# EAGLE design untitled (EAGLE 6.4)
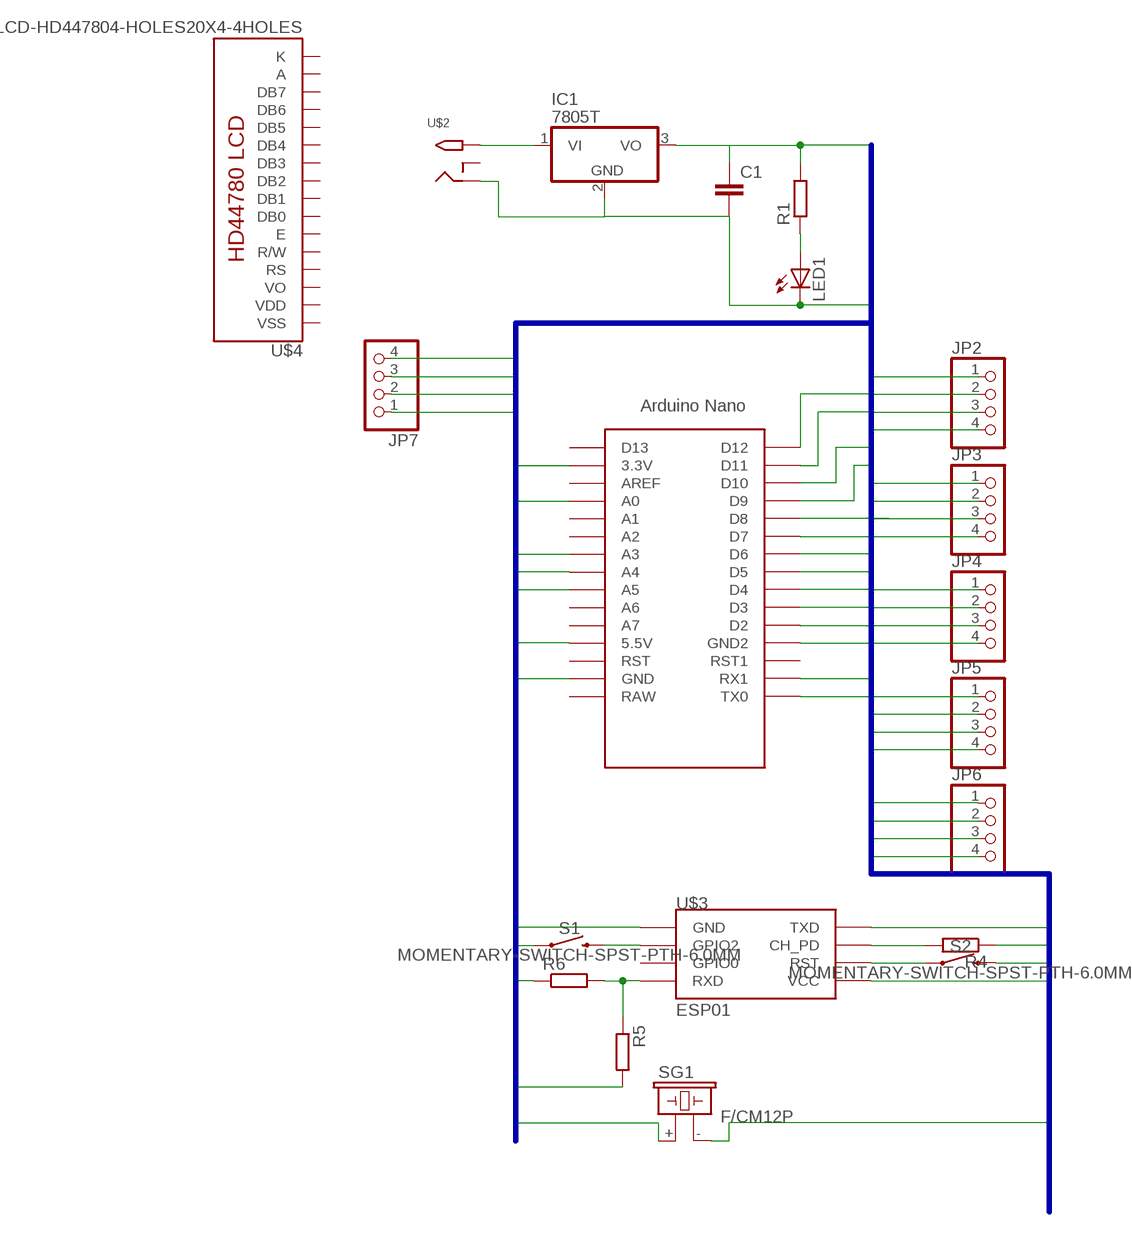
[diagram p0: schematic, sheet 1]

## Parts
C1  C-EU025-030X050  [C025-030X050]
IC1  7805T  [TO220H]
JP2  PINHD-1X4  [1X04]
JP3  PINHD-1X4  [1X04]
JP4  PINHD-1X4  [1X04]
JP5  PINHD-1X4  [1X04]
JP6  PINHD-1X4  [1X04]
JP7  PINHD-1X4  [1X04]
LED1  LED5MM  [LED5MM]
R1  R-EU_0204/7  [0204/7]
R4  R-EU_0204/7  [0204/7]
R5  R-EU_0204/7  [0204/7]
R6  R-EU_0204/7  [0204/7]
S1  MOMENTARY-SWITCH-SPST-PTH-6.0MM  [TACTILE_SWITCH_PTH_6.0MM]
S2  MOMENTARY-SWITCH-SPST-PTH-6.0MM  [TACTILE_SWITCH_PTH_6.0MM]
SG1  F/CM12P  [F/CM12P]
U$1  NANO  [NANO]
U$2  2.1MMJACKTHM  [PJ-102A]
U$3  ESP01  [ESP01]
U$4  LCD-HD447804-HOLES20X4-4HOLES  [LCD-20X4-4HOLES]

## Nets
3V: R4.1 U$1.3.3V U$3.VCC
BUZZ: SG1.+ U$1.A3
E1: JP2.3 U$1.D11
E2: JP3.3 U$1.D9
E3: JP4.3 U$1.D7
E4: JP5.3 U$1.D5
E5: JP6.3 U$1.A0
GND: C1.2 IC1.2(GND) JP2.4 JP3.4 JP4.4 JP5.4 JP6.4 JP7.1 LED1.K(C) R5.2 S1.1 S2.3 SG1.- U$1.GND U$1.GND1(GND2) U$2.RING U$3.GND
N$1: IC1.1(VI) U$2.TIP
N$2: R4.2 U$3.CH_PD
N$3: R5.1 R6.2 U$3.RX(RXD)
N$4: LED1.A R1.1
N$5: S1.3 U$3.GPIO2
N$6: S2.1 U$3.RST
RX: U$1.RX1
RXS: U$1.D3 U$3.TX(TXD)
SCL: JP7.3 U$1.A5
SDA: JP7.2 U$1.A4
T1: JP2.2 U$1.D12
T2: JP3.2 U$1.D10
T3: JP4.2 U$1.D8
T4: JP5.2 U$1.D6
T5: JP6.2 U$1.D4
TX: U$1.TX0
TXS: R6.1 U$1.D2
VCC: C1.1 IC1.3(VO) JP2.1 JP3.1 JP4.1 JP5.1 JP6.1 JP7.4 R1.2 U$1.5V(5.5V)
Unconnected: U$1.A1 U$1.A2 U$1.A6 U$1.A7 U$1.AREF U$1.D13 U$1.ICSP1 U$1.ICSP2 U$1.ICSP3 U$1.ICSP4 U$1.ICSP5 U$1.ICSP6 U$1.RAW U$1.RST U$1.RST1 U$2.RING_SW U$3.GPIO0 U$4.P$3(VO) U$4.P$4(RS) U$4.P$5(R/W) U$4.P$6(E) U$4.P$7(DB0) U$4.P$8(DB1) U$4.P$9(DB2) U$4.P$10(DB3) U$4.P$11(DB4) U$4.P$12(DB5) U$4.P$13(DB6) U$4.P$14(DB7)

## Buses
E1,T1,E2,T2,E3,T3,E4,T4,E5,T5,VCC,GND,3V,SCL,SDA,RX,TX,RXS,TXS,BUZZ

## Power pins joined to a net without a drawn wire
A: U$4.P$15(A)
K: U$4.P$16(K)
VDD: U$4.P$2(VDD)
VSS: U$4.P$1(VSS)

## Library data of the parts
C1 = rcl:C-EU: CAPACITOR, European symbol
IC1 = adafruit:78*: Positive VOLTAGE REGULATOR Added bigger pads to the TO-92 package
JP2-JP7 = pinhead:PINHD-1X4: PIN HEADER
LED1 = adafruit:LED: LED OSRAM: - CHIPLED LG R971, LG N971, LY N971, LG Q971, LY Q971, LO R971, LY R971 LH N974, LH R974 LS Q976, LO Q976, LY Q976 LO Q996 - Hyper CHIPLED LW Q18S LB Q993, LB Q99A, LB R99A - SideLED LS A670, LO A670, LY A670, LG A670, LP A670 LB A673, LV A673, LT A673, LW A673 LH A674 LY A675 LS A676, LA A676, LO A676, LY A676, LW A676 LS A679, LY A679, LG A679 - Hyper Micro SIDELED® LS Y876, LA Y876, LO Y876, LY Y876 LT Y87S - SmartLED LW L88C, LW L88S LB L89C, LB L89S, LG L890 LS L89K, LO L89K, LY L89K LS L896, LA L896, LO L896, LY L896 - TOPLED LS T670, LO T670, LY T670, LG T670, LP T670 LSG T670, LSP T670, LSY T670, LOP T670, LYG T670 LG T671, LOG T671, LSG T671 LB T673, LV T673, LT T673, LW T673 LH T674 LS T676, LA T676, LO T676, LY T676, LB T676, LH T676, LSB T676, LW T676 LB T67C, LV T67C, LT T67C, LS T67K, LO T67K, LY T67K, LW E67C LS E67B, LA E67B, LO E67B, LY E67B, LB E67C, LV E67C, LT E67C LW T67C LS T679, LY T679, LG T679 LS T770, LO T770, LY T770, LG T770, LP T770 LB T773, LV T773, LT T773, LW T773 LH T774 LS E675, LA E675, LY E675, LS T675 LS T776, LA T776, LO T776, LY T776, LB T776 LHGB T686 LT T68C, LB T68C - Hyper Mini TOPLED® LB M676 - Mini TOPLED Santana® LG M470 LS M47K, LO M47K, LY M47K Source: http://www.osram.convergy.de/
R1 R4-R6 = rcl:R-EU_: RESISTOR, European symbol
S1 S2 = SparkFun-Switches:MOMENTARY-SWITCH-SPST: Momentary Switch (Pushbutton) - SPST Normally-open (NO) SPST momentary switches (buttons, pushbuttons). Variants PTH-12MM - 12mm square, through-hole Momentary Pushbutton Switch - 12mm Square <https://www.sparkfun.com/products/9190> (COM-09190) PTH-6.0MM, PTH-6.0MM-KIT - 6.0mm square, through-hole Mini Pushbutton Switch <https://www.sparkfun.com/products/97> (COM-00097) KIT package intended for soldering kit's - only one side of pads' copper is exposed. PTH-RIGHT-ANGLE-KIT - Right-angle, through-hole Right Angle Tactile Button <https://www.sparkfun.com/products/10791> - Used on SparkFun BigTime Watch Kit <https://www.sparkfun.com/products/11734> SMD-12MM - 12mm square, surface-mount Tactile Button - SMD (12mm) <https://www.sparkfun.com/products/12993> (COM-12993) Used on SparkFun PicoBoard <https://www.sparkfun.com/products/11888> SMD-4.5MM - 4.5mm Square Trackball Switch Used on SparkFun Blackberry Trackballer Breakout <https://www.sparkfun.com/products/13169> SMD-4.6MMX2.8MM - 4.60mm x 2.80mm, surface mount Used on SparkFun SAMD21 Mini Breakout <https://www.sparkfun.com/products/13664> SMD-5.2MM, SMD-5.2-REDUNDANT - 5.2mm square, surface-mount Mini Pushbutton Switch - SMD <https://www.sparkfun.com/products/8720> (COM-08720) Used on Arduino Pro Mini <https://www.sparkfun.com/products/11114> REDUNDANT package connects both switch circuits together SMD-6.0X3.5MM - 6.0 x 3.5mm, surface mount Momentary Reset Switch SMD <https://www.sparkfun.com/products/8229> (COM-08229) SMD-6.2MM-TALL - 6.2mm square, surface mount Tactile Button - SMD (6mm) <https://www.sparkfun.com/products/12992> Used on SparkFun Digital Sandbox <https://www.sparkfun.com/products/12651> SMD-RIGHT-ANGLE - Right-angle, surface mount Used on SparkFun Block for Intel® Edison - Arduino <https://www.sparkfun.com/products/13036>; PROD_ID: SWCH-08441; SF_SKU: COM-00097
SG1 = buzzer:F/CM12P: BUZZER Source: Buerklin; OC_FARNELL: unknown; OC_NEWARK: unknown
U$1 = Arduino-clone:NANO: Arduino Nano
U$2 = adafruit:2.1MMJACK: 2.1mm x 5.5mm THM DC jack with internal switch. Digikey part #PJ-102A, 4UCON part #05537 2.1mm x 5.5mm SMT DC jack with internal switch. Digikey part #PJ-002A-SMT, 4UCON part #03267 By microbuilder.eu & adafruit.com
U$3 = esp8266modules:ESP01: ESP8266 Wifi module 01
U$4 = HD44780LCD:LCD-HD44780

## Board
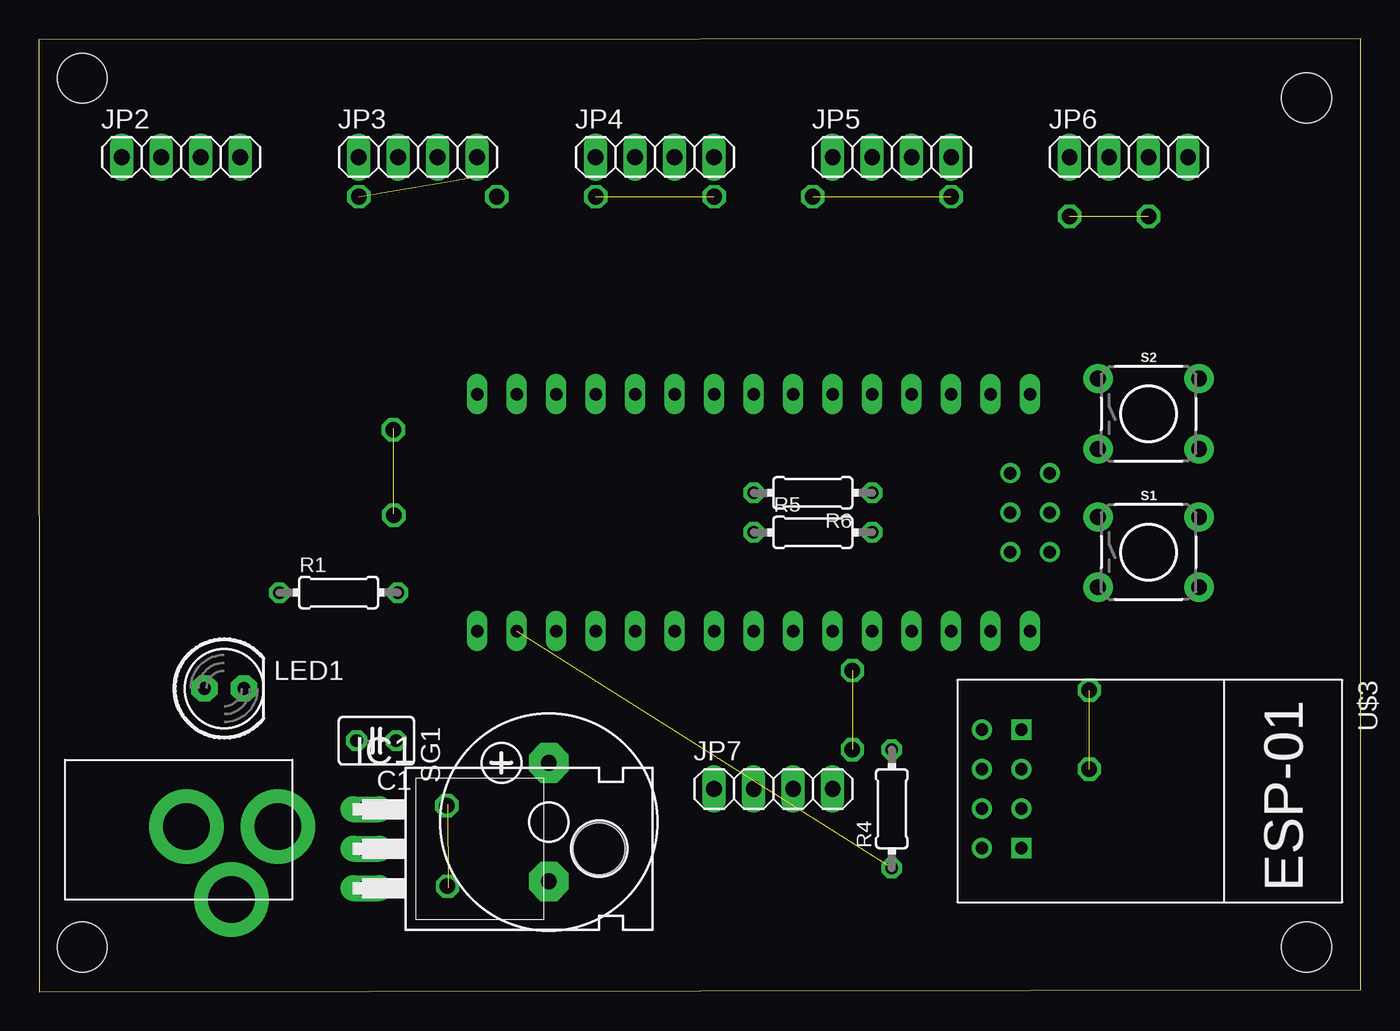
[diagram p1: board, top side]
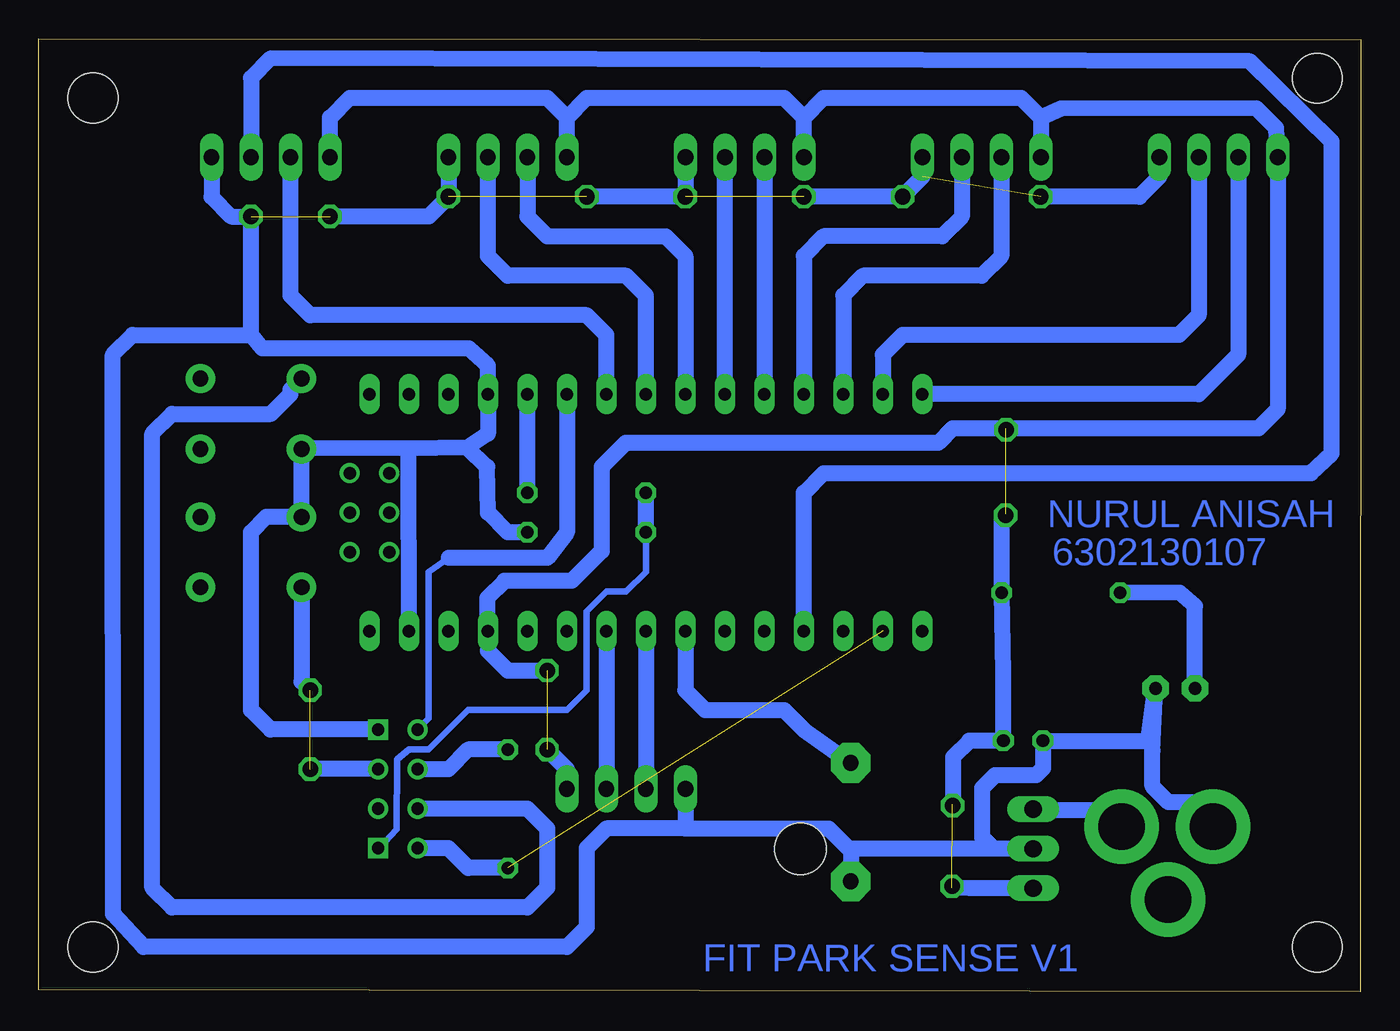
[diagram p2: board, bottom side, seen from below]

Size 85.01 x 61.3 mm. Coordinates in mm from the lower left corner, seen from the top.
Outline: 0.04,0 85.01,0.12 85.01,61.3 0,61.23 0.04,0
Copper layers (1*16): Top 0.035mm / dielectric 1.5mm / Bottom 0.035mm
Design rules "default": minimum track width 10mil, minimum drill 24mil, track to track 8mil, track to pad 8mil, pad to pad 8mil, via to via 8mil, smd to smd 8mil, copper to edge 40mil, drill to drill 8mil, minimum pad ring 10mil, minimum via ring 8mil, stop-mask expansion 4mil, vias tented up to drill 0mil, thermal gap 10mil
Holes 3.2 mm at 81.53,57.5 81.53,2.89 2.79,2.89 2.79,58.77

### Footprints (pad centres in the part's own frame; a part is rotated, then mirrored left to right if it is on the bottom)
C025-030X050 = drill 0.813 octagon: 1 -1.27,0; 2 1.27,0
TO220H = drill 1.118 long: 1 -2.54,-10.16; 2 0,-10.16; 3 2.54,-10.16 | hole 3.302: 0,4.826
1X04 = drill 1.016 long: 1 -3.81,0; 2 -1.27,0; 3 1.27,0; 4 3.81,0
LED5MM = drill 0.813 pad 1.676 octagon: A -1.27,0; K 1.27,0
0204/7 = drill 0.813 octagon: 1 -3.81,0; 2 3.81,0
TACTILE_SWITCH_PTH_6.0MM = drill 1.016 pad 1.88: 1 -3.251,2.261; 2 3.251,2.261; 3 -3.251,-2.261; 4 3.251,-2.261
F/CM12P = drill 1.016 pad 2.54 octagon: + 3.81,0; - -3.81,0
NANO = drill 0.8 long: 3.3V -10.16,24.13; 5V -10.16,-1.27; A0 -10.16,19.05; A1 -10.16,16.51; A2 -10.16,13.97; A3 -10.16,11.43; A4 -10.16,8.89; A5 -10.16,6.35; A6 -10.16,3.81; A7 -10.16,1.27; AREF -10.16,21.59; D2 5.08,1.27; D3 5.08,3.81; D4 5.08,6.35; D5 5.08,8.89; D6 5.08,11.43; D7 5.08,13.97; D8 5.08,16.51; D9 5.08,19.05; D10 5.08,21.59; D11 5.08,24.13; D12 5.08,26.67; D13 -10.16,26.67; GND -10.16,-6.35; GND1 5.08,-1.27; RAW -10.16,-8.89; RST -10.16,-3.81; RST1 5.08,-3.81; RX1 5.08,-6.35; TX0 5.08,-8.89 | drill 0.8: ICSP1 -5.08,-10.16; ICSP2 -5.08,-7.62; ICSP3 -2.54,-10.16; ICSP4 -2.54,-7.62; ICSP5 0,-10.16; ICSP6 0,-7.62
PJ-102A = drill 3 pad 4.8: RING 0.1,-3.39; RING_SW -4.6,-6.29; TIP 0.1,-9.29
ESP01 = drill 0.8: CH_PD -1.285,-8.178; GPIO0 1.255,-5.638; GPIO2 -1.285,-5.638; RST 1.255,-8.178; TX -3.825,-8.178; VCC 3.795,-8.178 | drill 0.8 square: GND -3.825,-5.638; RX 3.795,-5.638
LCD-20X4-4HOLES = drill 1.016 square: P$1 10,57.5 | drill 1.016: P$2 12.54,57.5; P$3 15.08,57.5; P$4 17.62,57.5; P$5 20.16,57.5; P$6 22.7,57.5; P$7 25.24,57.5; P$8 27.78,57.5; P$9 30.32,57.5; P$10 32.86,57.5; P$11 35.4,57.5; P$12 37.94,57.5; P$13 40.48,57.5; P$14 43.02,57.5; P$15 45.56,57.5; P$16 48.1,57.5 | hole 3.2: 2.5,2.5; 2.5,57.5; 95.5,57.5; 95.5,2.5

### Placement (x,y rotation side)
C1  21.71,16.15 180 top
IC1  31.21,9.2 270 top
JP2  9.14,53.69 0 top
JP3  24.38,53.69 0 top
JP4  39.62,53.69 0 top
JP5  54.86,53.69 0 top
JP6  70.1,53.69 0 top
JP7  47.24,13.05 0 top
LED1  11.92,19.51 0 top
R1  19.28,25.68 0 top
R4  54.86,11.78 90 top
R5  49.78,29.56 0 top
R6  49.78,32.1 180 top
S1  71.37,28.29 0 top
S2  71.37,37.18 0 top
SG1  32.8,10.91 90 top
U$1  54.86,33.37 90 top
U$2  6.09,10.52 90 top
U$3  68.83,13.05 270 top
U$4  123.44,-21.24 0 top  (outside the outline)

### Tracks (layer width: path | path; a pad name or v marks a point on that pad's centre or on a via)
3V  (1 unrouted)
  Bottom 1.016: R4.1 57.4,7.97 58.67,9.24 60.64,9.24 U$3.VCC
BUZZ
  Bottom 1.016: U$1.A3 43.43,19.4 42.16,18.13 37.08,18.13 35.81,16.86 SG1.+
E1
  Bottom 1.016: JP2.3 10.41,43.53 11.68,42.26 29.46,42.26 30.73,40.99 U$1.D11
E2
  Bottom 1.016: JP3.3 25.65,49.88 26.92,48.61 34.54,48.61 35.81,47.34 U$1.D9
E3
  Bottom 1.016: U$1.D7 JP4.3
E4
  Bottom 1.016: U$1.D5 45.97,44.8 47.24,46.07 54.86,46.07 56.13,47.34 JP5.3
E5
  Bottom 1.016: U$1.A0 35.81,32.1 34.54,33.37 3.2,33.37 1.86,34.64 1.86,54.68 7.12,59.85 70.1,60.04 71.37,58.77 JP6.3
GND  (via drill 1)  (4 unrouted)
  Bottom 1.016: JP5.4 v58.67,51.15 59.94,49.88 v66.29,49.88 | JP6.4 73.91,51.15 72.64,49.88 v71.37,49.88 71.37,42.26 | JP4.4 v43.43,51.15 v49.78,51.15 | JP3.4 28.19,52.42 v29.46,51.15 v35.81,51.15 | JP2.4 12.95,52.42 14.22,51.15 v20.57,51.15 | 57.48,35.01 56.13,35.91 U$1.GND1 56.13,40.27 57.36,41.39 70.65,41.39 71.37,42.26 | 57.48,35.01 61.23,34.96 | 61.23,34.96 67.78,34.97 S2.3 S1.1 70.38,30.55 71.37,29.56 71.37,18.13 70.12,16.87 U$3.GND | U$1.GND 61.23,34.96 | R5.2 54.86,29.56 56.13,30.83 56.17,33.76 57.48,35.01 | 43.43,10.51 48.51,10.51 49.78,9.24 49.78,4.16 51.05,2.89 78.27,2.89 80.23,5.01 80.26,40.99 78.99,42.26 71.37,42.26 | JP7.1 43.43,10.51 | U$2.RING 9.48,10.93 10.74,12.18 12.35,12.18 13.39,13.22 13.39,15.5 LED1.K 13.64,16.15 C1.2 20.42,16.13 20.42,14.39 20.87,13.94 23.5,13.94 24.33,13.11 24.33,9.93 23.6,9.2 IC1.2 32.91,9.2 | 43.43,10.51 34.22,10.51 32.91,9.2 | 32.91,9.2 32.77,9.06 32.77,7.13 SG1.-
N$1
  Bottom 1.016: U$2.TIP 15.38,10.83 16.21,11.66 20.98,11.66 IC1.1
N$2
  Bottom 1.016: R4.2 57.4,15.59 58.67,14.32 60.64,14.32 U$3.CH_PD
N$3
  Bottom 0.406: R5.1 45.97,27.02 47.24,25.75 48.51,25.75 49.78,24.48 49.78,19.4 51.05,18.13 57.4,18.13 59.94,15.59 61.21,15.59 61.96,14.96 61.99,10.44 63.1,9.27 U$3.RX
  Bottom 1.016: R5.1 R6.2
N$4
  Bottom 1.016: LED1.A 10.65,19.69 10.65,24.81 11.64,25.66 R1.1
N$5  (via drill 1)  (1 unrouted)
  Bottom 1.016: S1.3 68.12,19.95 v67.56,19.4 | U$3.GPIO2 67.55,14.33 v67.56,14.32
N$6
  Bottom 1.016: U$3.RST 53.61,11.79 52.32,10.51 52.32,6.7 53.59,5.43 76.45,5.43 77.72,6.7 77.72,35.91 76.45,37.18 70.1,37.18 68.83,38.45 68.83,38.72 S2.1
N$7  (via drill 1)
  other vias: 22.84,30.64
N$8  (via drill 1)
  other vias: 22.79,36.14
N$9  (via drill 1)
  other vias: 26.23,11.97
N$10  (via drill 1)
  other vias: 26.29,6.79
RXS
  Bottom 0.406: U$3.TX 59.94,17.58 59.94,27.02 58.65,27.92
  Bottom 1.016: U$1.D3 51.05,29.56 52.3,27.92 58.65,27.92
SCL
  Bottom 1.016: U$1.A5 JP7.3
SDA
  Bottom 1.016: U$1.A4 JP7.2
T1
  Bottom 1.016: JP2.2 7.87,40.99 10.41,38.45 U$1.D12
T2
  Bottom 1.016: JP3.2 23.11,47.34 24.38,46.07 32,46.07 33.27,44.8 U$1.D10
T3
  Bottom 1.016: JP4.2 U$1.D8
T4
  Bottom 1.016: JP5.2 53.59,49.88 52.32,48.61 44.7,48.61 43.43,47.34 U$1.D6
T5
  Bottom 1.016: U$1.D4 48.51,42.26 49.78,43.53 67.56,43.53 68.83,44.8 JP6.2
TXS
  Bottom 1.016: R6.1 U$1.D2
VCC  (via drill 1)  (3 unrouted)
  Bottom 1.016: 20.57,56.23 19.27,56.82 6.71,56.83 5.44,55.56 JP2.1 5.33,37.48 6.57,36.24 26.25,36.24 27.17,35.31 47.27,35.31 48.82,33.76 48.82,28.35 50.74,26.43 55.07,26.43 56.18,25.32 56.18,22.71 56.13,22.66 | 20.57,56.23 JP3.1 | JP5.1 51.05,56.23 | 51.05,56.23 49.78,57.5 37.08,57.5 35.81,56.23 | JP6.1 66.29,56.23 65.02,57.5 52.32,57.5 51.05,56.23 | JP4.1 35.81,56.23 | 35.81,56.23 34.54,57.5 21.84,57.5 20.57,56.23 | JP7.4 51.05,14.32 v52.32,15.59 | U$1.5V 56.13,22.66 | 56.13,22.66 56.13,21.94 54.86,20.67 v52.32,20.67 | 22.81,30.75 23.09,30.47 R1.2 22.98,20.49 C1.1 25.17,16.15 26.21,15.11 26.21,12.15 26.3,12.05 | IC1.3 25.16,6.66 26.31,6.69

### Text on the board
Bottom: NURUL ANISAH | 6302130107 | FIT PARK SENSE V1